# EAGLE design rpi_exp_can (EAGLE 7.2.0)
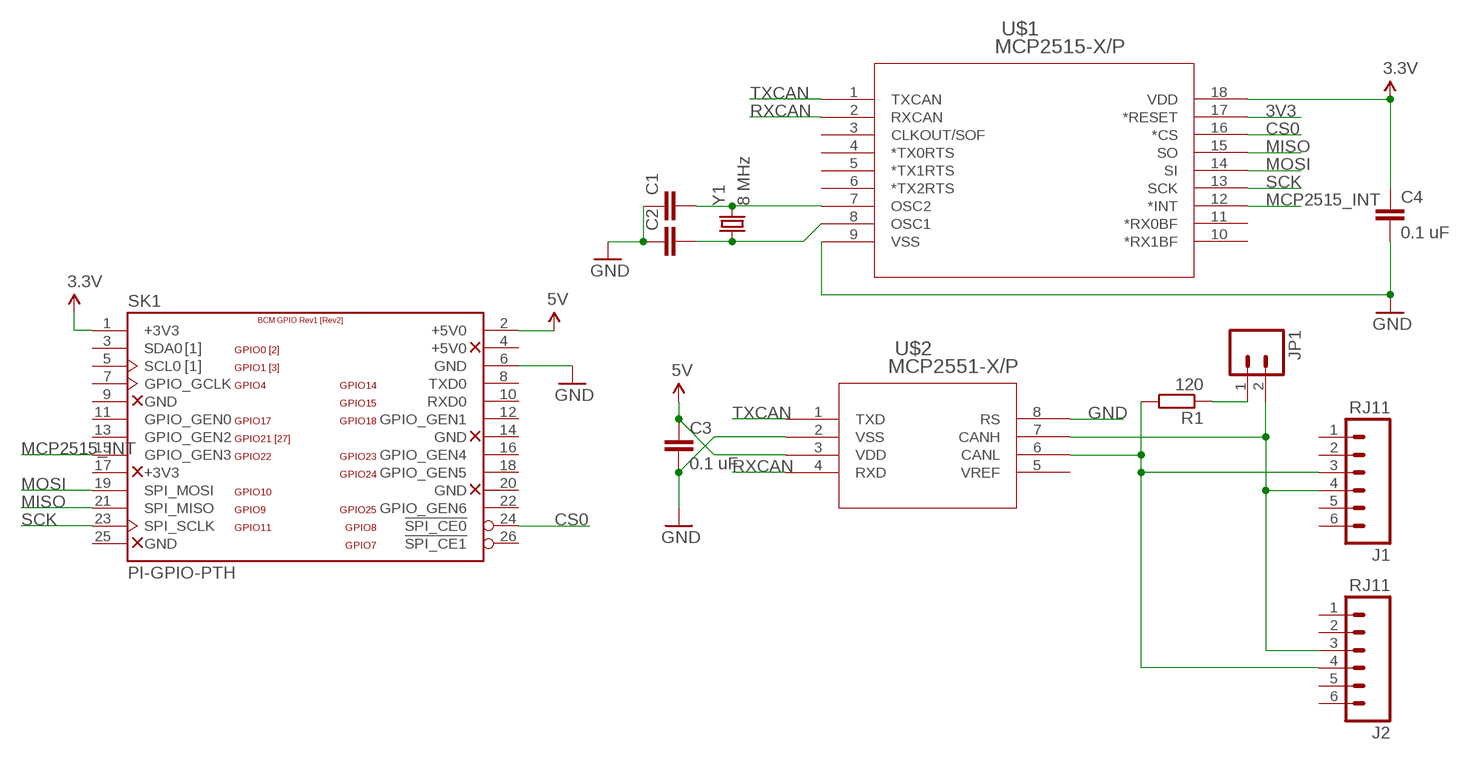
[diagram p0: schematic, sheet 1]

## Parts
C1  C-EU025-025X050  [C025-025X050]
C2  C-EU025-025X050  [C025-025X050]
C3  0.1 uF  C-EU050-030X075  [C050-030X075]
C4  0.1 uF  C-EU050-030X075  [C050-030X075]
J1  RJ11  RJ11-6PTH  [RJ11-6]
J2  RJ11  RJ11-6PTH  [RJ11-6]
JP1  M02PTH  [1X02]
R1  120  R-EU_0207/10  [0207/10]
SK1  PI-GPIO-PTH  [GPIO-CONNECTOR]
U$1  MCP2515-X/P  [PDIP18_300MC]
U$2  MCP2551-X/P  [PDIP8_300MC]
Y1  8 MHz  CRYSTALHC49US  [HC49US]

## Nets
3.3V: C4.1 SK1.1(+3V3) U$1.18(VDD)
3V3: U$1.17(*RESET)
5V: C3.1 SK1.2(+5V0) U$2.3(VDD)
CS0: SK1.24(!SPI_CE0) U$1.16(*CS)
GND: C1.1 C2.1 C3.2 C4.2 SK1.6(GND) U$1.9(VSS) U$2.2(VSS) U$2.8(RS)
MCP2515_INT: SK1.15(GPIO_GEN3) U$1.12(*INT)
MISO: SK1.21(SPI_MISO) U$1.15(SO)
MOSI: SK1.19(SPI_MOSI) U$1.14(SI)
N$1: C1.2 U$1.7(OSC2) Y1.2
N$2: C2.2 U$1.8(OSC1) Y1.1
N$3: J1.3 J2.4 R1.2 U$2.6(CANL)
N$4: JP1.1 R1.1
N$5: J1.4 J2.3 JP1.2 U$2.7(CANH)
RXCAN: U$1.2(RXCAN) U$2.4(RXD)
SCK: SK1.23(SPI_SCLK) U$1.13(SCK)
TXCAN: U$1.1(TXCAN) U$2.1(TXD)
Unconnected: J1.1 J1.2 J1.5 J1.6 J2.1 J2.2 J2.5 J2.6 SK1.3(SDA0) SK1.4(+5V0) SK1.5(SCL0) SK1.7(GPIO_GCLK) SK1.8(TXD0) SK1.9(GND) SK1.10(RXD0) SK1.11(GPIO_GEN0) SK1.12(GPIO_GEN1) SK1.13(GPIO_GEN2) SK1.14(GND) SK1.16(GPIO_GEN4) SK1.17(+3V3) SK1.18(GPIO_GEN5) SK1.20(GND) SK1.22(GPIO_GEN6) SK1.25(GND) SK1.26(!SPI_CE1) U$1.3(CLKOUT/SOF) U$1.4(*TX0RTS) U$1.5(*TX1RTS) U$1.6(*TX2RTS) U$1.10(*RX1BF) U$1.11(*RX0BF) U$2.5(VREF)

## Library data of the parts
C1-C4 = rcl:C-EU: CAPACITOR, European symbol
J1 J2 = SparkFun-Connectors:RJ11-6: RJ11 Jack Simple 6 pin RJ11 jack. Commonly found on CAT3 devices and Microchip programmers. SKU: PRT-00132; PROD_ID: CONN-08590
JP1 = SparkFun-Connectors:M02: Standard 2-pin 0.1" header. Use with - straight break away headers ( PRT-00116) - right angle break away headers (PRT-00553) - swiss pins (PRT-00743) - machine pins (PRT-00117) - female headers (PRT-00115) Molex polarized connector foot print use with: PRT-08233 with associated crimp pins and housings. 2.54_SCREWTERM for use with PRT-10571. 3.5mm Screw Terminal footprints for PRT-08084 5mm Screw Terminal footprints for use with PRT-08432
R1 = rcl:R-EU_: RESISTOR, European symbol
SK1 = jt-raspberry-pi:PI-: Raspberry Pi
U$1 = Locker-custom:MCP2515-X/P
U$2 = Locker-custom:MCP2551-X/P
Y1 = SparkFun-FreqCtrl:CRYSTAL: Various standard crystals. Proven footprints.

## Board
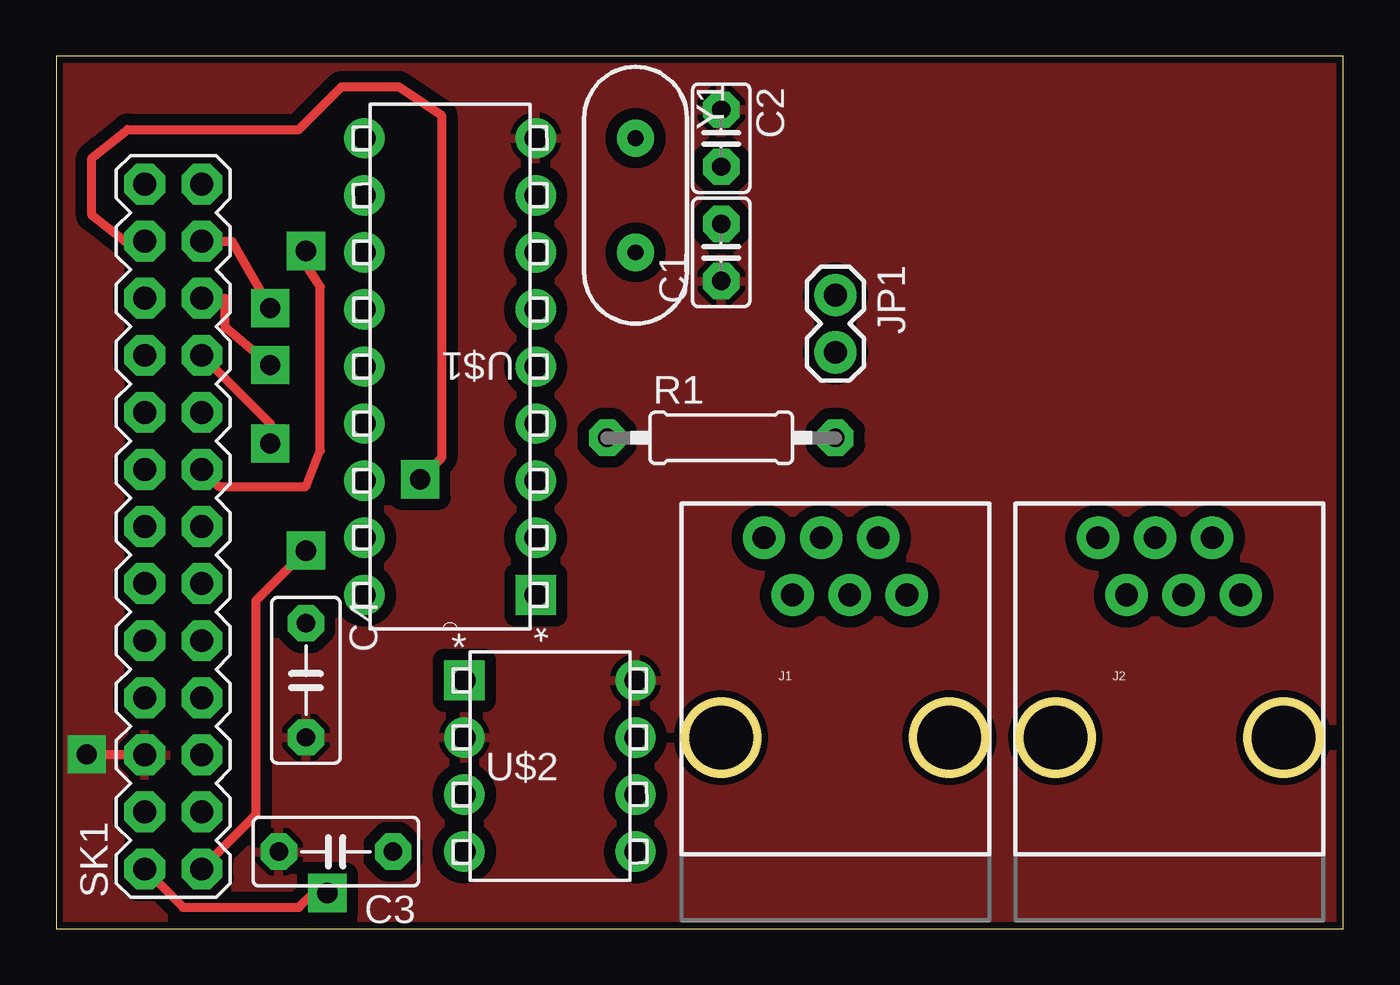
[diagram p1: board, top side]
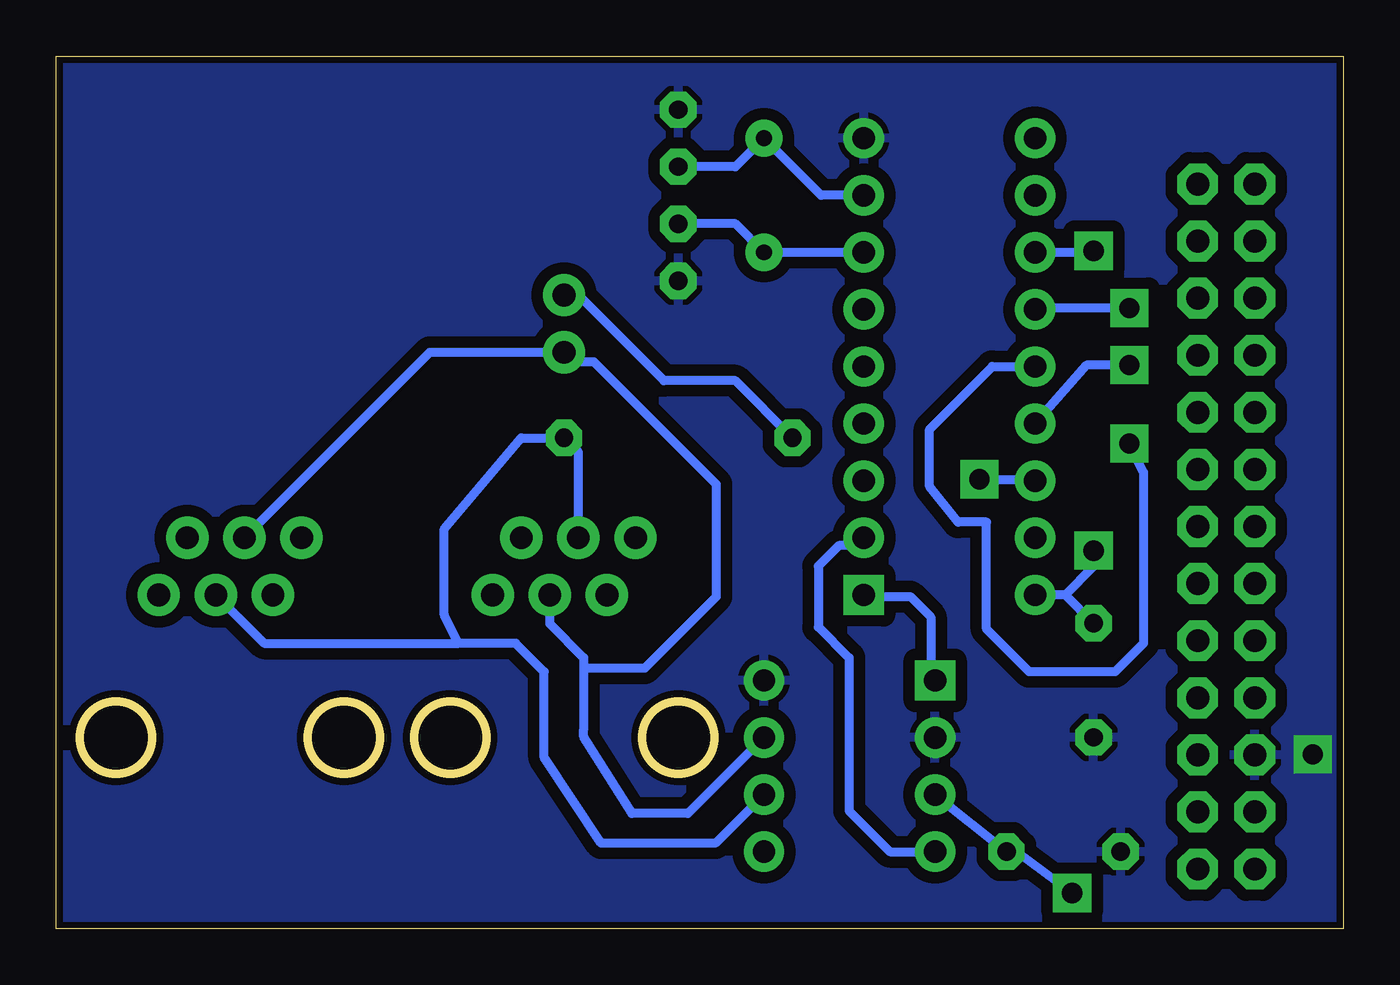
[diagram p2: board, bottom side, seen from below]

Size 57.27 x 38.83 mm. Coordinates in mm from the lower left corner, seen from the top.
Outline: 0,0 57.27,0 57.27,38.83 0,38.83 0,0
Outline: circle at 29.59,8.51 radius 1.6
Outline: circle at 39.74,8.51 radius 1.6
Outline: circle at 54.61,8.51 radius 1.6
Outline: circle at 44.46,8.51 radius 1.6
Copper layers (1*16): Top 0.035mm / dielectric 1.5mm / Bottom 0.035mm
Design rules "SparkFun *": minimum track width 0.4mm, minimum drill 0.8mm, track to track 20mil, track to pad 0.8mm, pad to pad 0.45mm, via to via 0.8mm, smd to smd 8mil, copper to edge 10mil, drill to drill 8mil, minimum pad ring 0.4mm, minimum via ring 0.4mm, stop-mask expansion 4mil, vias tented up to drill 20mil, thermal gap 10mil

### Footprints (pad centres in the part's own frame; a part is rotated, then mirrored left to right if it is on the bottom)
C025-025X050 = drill 0.813 octagon: 1 -1.27,0; 2 1.27,0
C050-030X075 = drill 0.813 octagon: 1 -2.54,0; 2 2.54,0
RJ11-6 = drill 1.016 pad 1.88: 1 -3.175,8.89; 2 -1.905,6.35; 3 -0.635,8.89; 4 0.635,6.35; 5 1.905,8.89; 6 3.175,6.35 | hole 3.251: -5.08,0; 5.08,0
1X02 = drill 1.016 pad 1.88: 1 0,0; 2 2.54,0
0207/10 = drill 0.813 octagon: 1 -5.08,0; 2 5.08,0
GPIO-CONNECTOR = drill 1.016 pad 1.676 octagon: 1 -15.24,-1.27; 2 -15.24,1.27; 3 -12.7,-1.27; 4 -12.7,1.27; 5 -10.16,-1.27; 6 -10.16,1.27; 7 -7.62,-1.27; 8 -7.62,1.27; 9 -5.08,-1.27; 10 -5.08,1.27; 11 -2.54,-1.27; 12 -2.54,1.27; 13 0,-1.27; 14 0,1.27; 15 2.54,-1.27; 16 2.54,1.27; 17 5.08,-1.27; 18 5.08,1.27; 19 7.62,-1.27; 20 7.62,1.27; 21 10.16,-1.27; 22 10.16,1.27; 23 12.7,-1.27; 24 12.7,1.27; 25 15.24,-1.27; 26 15.24,1.27
PDIP18_300MC = drill 0.991 square: 1 -7.62,20.32 | drill 0.991: 2 -7.62,17.78; 3 -7.62,15.24; 4 -7.62,12.7; 5 -7.62,10.16; 6 -7.62,7.62; 7 -7.62,5.08; 8 -7.62,2.54; 9 -7.62,0; 10 0,0; 11 0,2.54; 12 0,5.08; 13 0,7.62; 14 0,10.16; 15 0,12.7; 16 0,15.24; 17 0,17.78; 18 0,20.32
PDIP8_300MC = drill 0.991 square: 1 -7.62,7.62 | drill 0.991: 2 -7.62,5.08; 3 -7.62,2.54; 4 -7.62,0; 5 0,0; 6 0,2.54; 7 0,5.08; 8 0,7.62
HC49US = drill 0.7 pad 1.651: 1 -2.54,0; 2 2.54,0

### Placement (x,y rotation side)
C1  29.59,30.1 90 top
C2  29.59,35.18 270 top
C3  12.45,3.43 180 top
C4  11.11,11.05 270 top
J1  34.67,8.51 0 top
J2  49.53,8.51 0 top
JP1  34.67,28.19 270 top
R1  29.59,21.84 0 top
SK1  5.21,17.9 90 top
U$1  13.72,35.18 180 top
U$2  25.78,3.43 0 top
Y1  25.78,32.64 270 top

### Tracks (layer width: path | path; a pad name or v marks a point on that pad's centre or on a via)
3.3V  (via drill 0.9)
  Top 0.406: SK1.1 6.48,2.67 8.89,5.08 8.89,14.61 v11.11,16.83
  Bottom 0.406: C4.1 12.38,14.86 | 12.38,14.86 U$1.18 | v11.11,16.83 11.11,16.12 12.38,14.86
5V  (via drill 0.9 pad 1.68)
  Top 0.406: SK1.2 5.65,0.95 10.79,0.95 11.43,1.59 v12.06,1.59
  Bottom 0.406: U$2.3 C3.1 14.54,3.43 v12.06,1.59
CS0  (via drill 0.9)
  Top 0.406: v16.19,20 17.14,20.95 17.14,36.2 15.24,37.47 12.7,37.47 10.79,35.56 3.17,35.56 1.59,34.29 1.59,31.75 3.06,30.6 SK1.24
  Bottom 0.406: v16.19,20 13.78,20 U$1.16
GND  (via drill 0.9)
  Top 0.406: SK1.6 1.44,7.74 1.38,7.75
  other vias: 1.36,7.76
  pour Bottom (isolate 0.305): 0,0 57.27,0 57.27,38.83 0,38.83
  pour Top (isolate 0.305): 0,0 57.27,0 57.27,38.83 0,38.83
MCP2515_INT  (via drill 0.9)
  Top 0.406: SK1.15 7.24,19.68 11.11,19.68 11.75,21.27 11.75,28.57 11.11,29.53 v11.11,30.16
  Bottom 0.406: v11.11,30.16 11.18,30.1 U$1.12
MISO  (via drill 0.9)
  Top 0.406: SK1.21 7.5,28.06 7.5,26.79 v9.53,25.08
  Bottom 0.406: v9.53,25.08 11.43,25.08 U$1.15
MOSI  (via drill 0.9)
  Top 0.406: SK1.19 9.53,22.48 v9.53,21.59
  Bottom 0.406: v9.53,21.59 8.89,20.32 8.89,12.7 10.16,11.43 13.97,11.43 15.88,13.34 15.88,18.1 17.14,18.1 18.41,19.68 18.41,22.23 15.62,25.02 U$1.14
N$1
  Bottom 0.406: U$1.7 Y1.2 27.05,31.37 C1.2
N$2
  Bottom 0.406: U$1.8 23.24,32.64 Y1.1 27.05,33.91 C2.2
N$3
  Bottom 0.406: J1.3 34.04,21.21 R1.2 36.58,21.84 40.01,17.78 40.01,13.97 39.37,12.7 | U$2.6 27.94,3.81 33.02,3.81 35.56,7.62 35.56,11.43 36.83,12.7 39.37,12.7 | J2.4 48.01,12.7 39.37,12.7
N$4
  Bottom 0.406: R1.1 27.05,24.38 30.23,24.38 34.04,28.19 JP1.1
N$5
  Bottom 0.4: 33.8,12.06 33.8,11.6 | 33.8,11.6 33.8,8.88 | 33.8,11.6 31.07,11.6 27.89,14.78 27.89,19.78 33.34,25.22 34.25,25.22 JP1.2
  Bottom 0.406: 33.8,8.88 33.8,8.54 31.65,5.13 29.16,5.13 U$2.7 | 33.8,12.06 35.31,13.57 J1.4 | J2.3 40.64,25.65 JP1.2
RXCAN
  Bottom 0.4: 18.36,3.43 U$2.4
  Bottom 0.406: 18.36,3.43 20.18,3.43 21.99,5.25 21.99,12.06 23.35,13.42 23.35,16.14 22.45,17.05 21.54,17.05 U$1.2
SCK  (via drill 0.9)
  Top 0.406: SK1.23 7.82,30.6 v9.53,27.62
  Bottom 0.406: v9.53,27.62 13.65,27.62 U$1.13
TXCAN
  Bottom 0.4: 21.08,14.78 U$1.1
  Bottom 0.406: 21.08,14.78 19.27,14.78 18.36,13.87 18.36,11.15 U$2.1